# EAGLE design tinyduino-breakout-mk-2.0 (EAGLE 6.5.0)
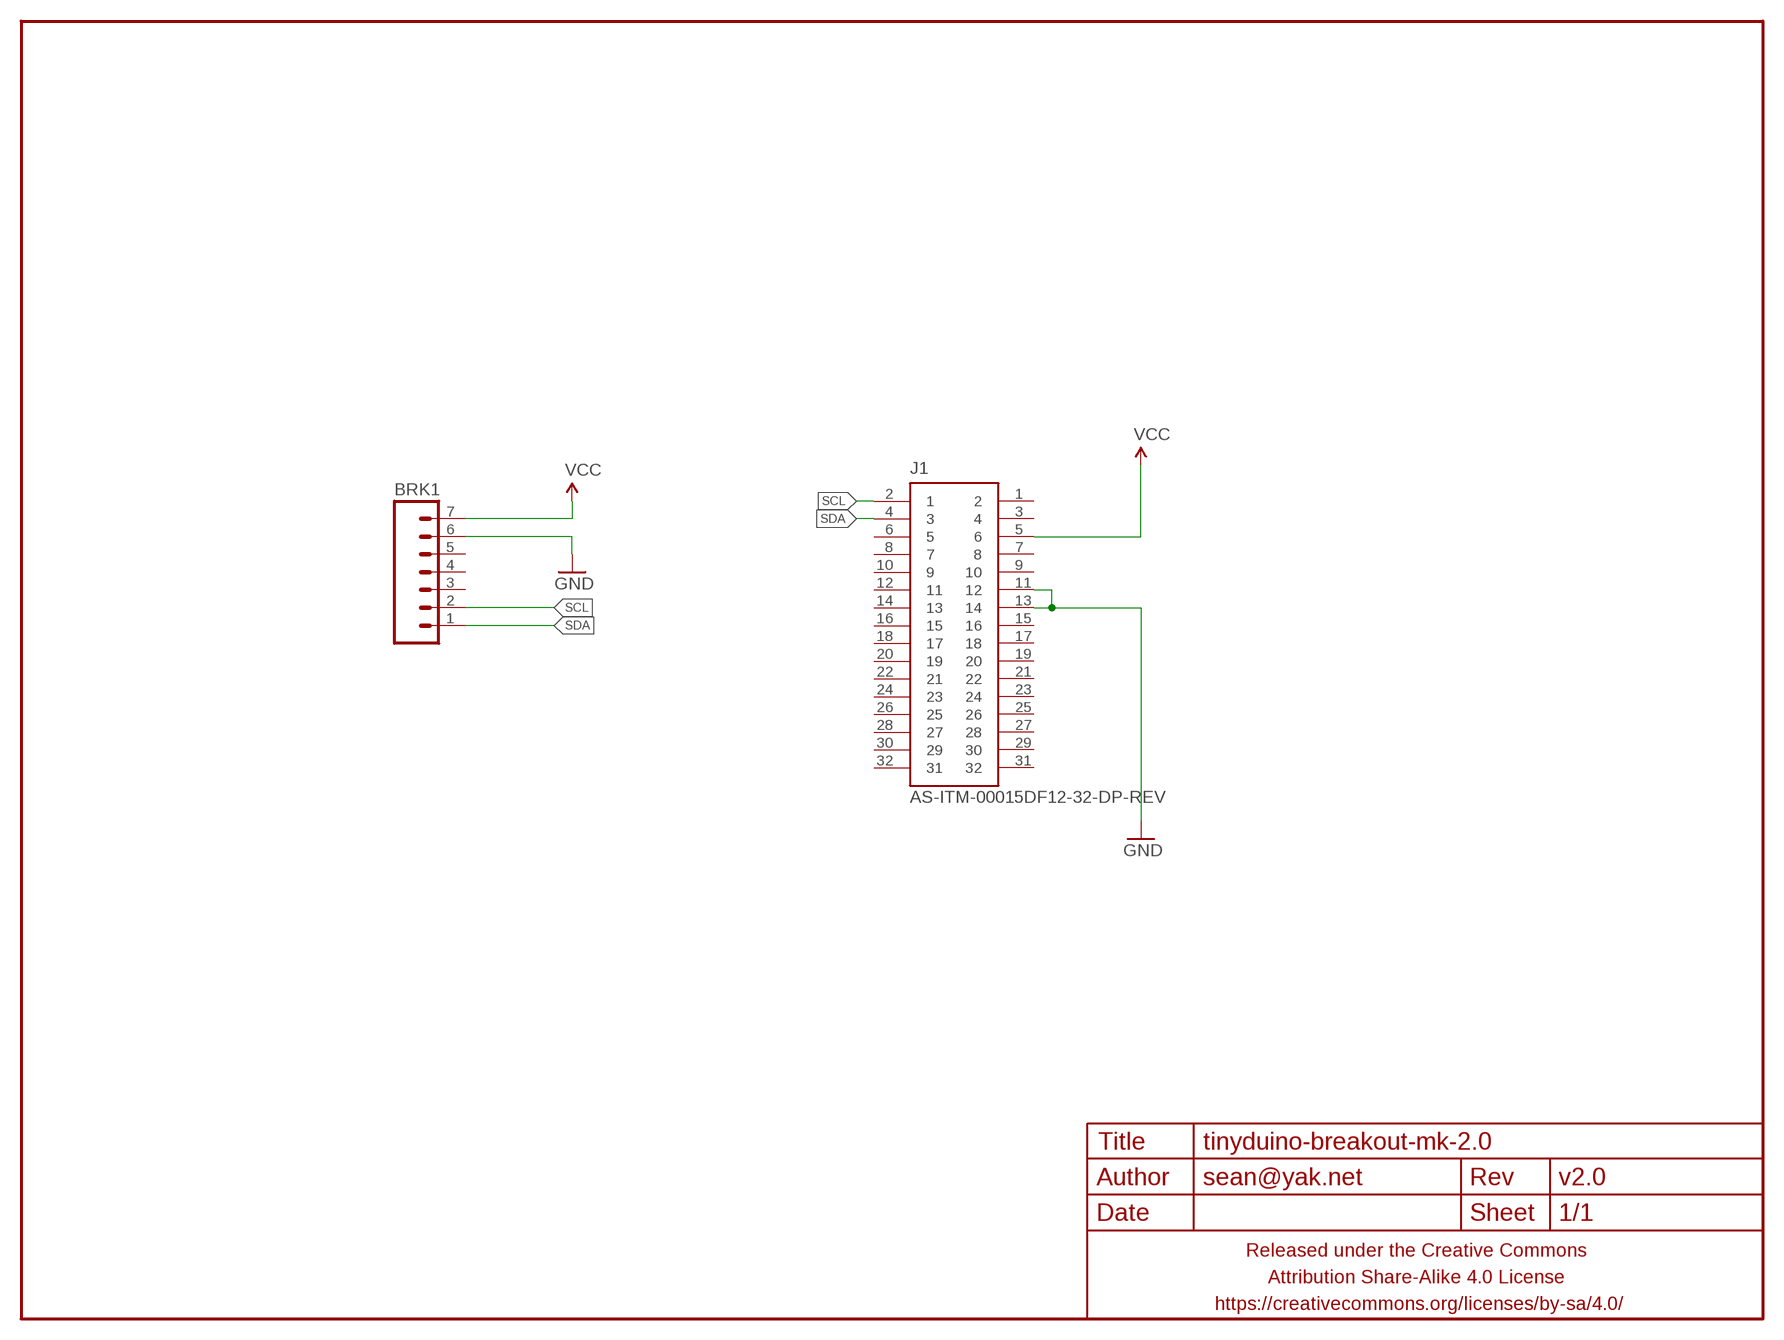
[diagram p0: schematic, sheet 1]

## Parts
BRK1  ADAFRUIT-SI1145-BREAKOUTSMD-RA  [1X07-SMD-SHORT]
FRAME1  FRAME-LETTERNO_PACKAGE  [DUMMY]
J1  AS-ITM-00015DF12-32-DP-REV  [DF12-32-DP]

## Nets
GND: BRK1.6(GND) J1.11 J1.13
SCL: BRK1.2(SCL) J1.2
SDA: BRK1.1(SDA) J1.4
VCC: BRK1.7(VIN) J1.5
Unconnected: BRK1.3(LED) BRK1.4(IRQ) BRK1.5(3V3_OUT) J1.1 J1.3 J1.6 J1.7 J1.8 J1.9 J1.10 J1.12 J1.14 J1.15 J1.16 J1.17 J1.18 J1.19 J1.20 J1.21 J1.22 J1.23 J1.24 J1.25 J1.26 J1.27 J1.28 J1.29 J1.30 J1.31 J1.32

## Library data of the parts
BRK1 = A_butts:ADAFRUIT-SI1145-BREAKOUT
FRAME1 = A_butts:FRAME-LETTER: Schematic Frame Standard 8.5x11 US Letter frame; DESIGNER: sean@yak.net; VERSION: v2.0
J1 = A_butts:AS-ITM-00015: CONN HEADER 32POS 3MM SMD 0.5MM

## Board
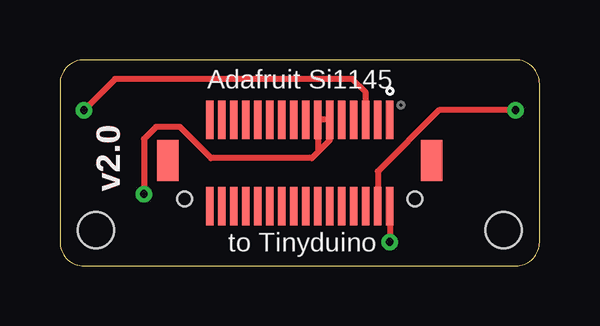
[diagram p1: board, top side]
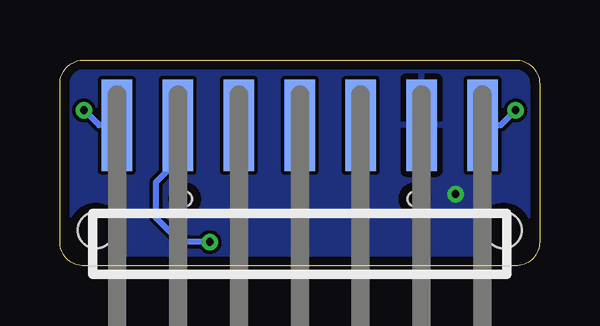
[diagram p2: board, bottom side, seen from below]

Size 20 x 8.6 mm. Coordinates in mm from the lower left corner, seen from the top.
Outline: 1,0 19,0 arc90 20,1 20,7.6 arc90 19,8.6 1,8.6 arc90 0,7.6 0,1 arc90 1,0
Copper layers (1*16): Top 0.0356mm / dielectric 1.5011mm / Bottom 0.0356mm
Design rules "LaenPCBOrder_2": minimum track width 6mil, minimum drill 13mil, track to track 6mil, track to pad 6mil, pad to pad 6mil, via to via 6mil, smd to smd 6mil, copper to edge 15mil, drill to drill 6mil, minimum pad ring 7mil, minimum via ring 7mil, stop-mask expansion 3mil, vias tented up to drill 20mil, thermal gap 10mil
Holes 1.5 mm at 1.5,1.5 18.5,1.5

### Footprints (pad centres in the part's own frame; a part is rotated, then mirrored left to right if it is on the bottom)
1X07-SMD-SHORT = smd 1.27 x 3.81: 1 -7.62,3.175; 2 -5.08,3.175; 3 -2.54,3.175; 4 0,3.175; 5 2.54,3.175; 6 5.08,3.175; 7 7.62,3.175
DF12-32-DP = smd 0.3 x 1.6: 1 -3.75,-1.8; 2 -3.75,1.8; 3 -3.25,-1.8; 4 -3.25,1.8; 5 -2.75,-1.8; 6 -2.75,1.8; 7 -2.25,-1.8; 8 -2.25,1.8; 9 -1.75,-1.8; 10 -1.75,1.8; 11 -1.25,-1.8; 12 -1.25,1.8; 13 -0.75,-1.8; 14 -0.75,1.8; 15 -0.25,-1.8; 16 -0.25,1.8; 17 0.25,-1.8; 18 0.25,1.8; 19 0.75,-1.8; 20 0.75,1.8; 21 1.25,-1.8; 22 1.25,1.8; 23 1.75,-1.8; 24 1.75,1.8; 25 2.25,-1.8; 26 2.25,1.8; 27 2.75,-1.8; 28 2.75,1.8; 29 3.25,-1.8; 30 3.25,1.8; 31 3.75,-1.8; 32 3.75,1.8 | smd 0.9 x 1.7: F1 -5.5,-0.1; F2 5.5,-0.1 | hole 0.6: -4.8,1.5; 4.8,1.5

### Placement (x,y rotation side)
BRK1  10,2.7 0 bottom
FRAME1  0,0 0 top
J1  10,4.3 180 top

### Tracks (layer width: path | path; a pad name or v marks a point on that pad's centre or on a via)
GND  (via drill 0.33)
  Top 0.25: v3.5,3 3.5,5.3 4,5.8 5,5.8 6.3,4.5 10.5,4.5 10.75,4.75 | 10.75,4.75 11.25,5.25 J1.11 J1.13 10.75,4.75
  pour Bottom: 20,7.6 20,1 arc-90 19,0 1,0 arc-90 0,1 0,7.6 arc-90 1,8.6 19,8.6 arc-90
SCL  (via drill 0.33)
  Top 0.25: J1.2 v13.75,1
  Bottom 0.25: v13.75,1 15,1 16,2 16,3.5 15.08,4.42 BRK1.2
SDA  (via drill 0.33)
  Top 0.25: v19,6.5 15.8,6.5 13.25,3.95 J1.4
  Bottom 0.25: BRK1.1 18.38,5.88 v19,6.5
VCC  (via drill 0.33)
  Top 0.25: J1.5 12.75,7.25 12.2,7.8 2.3,7.8 v1,6.5
  Bottom 0.25: BRK1.7 1.62,5.88 v1,6.5

### Text on the board
tPlace: Adafruit Si1145 | to Tinyduino